# Altium schematic sheet Surface V2.0.SchDoc
size A4
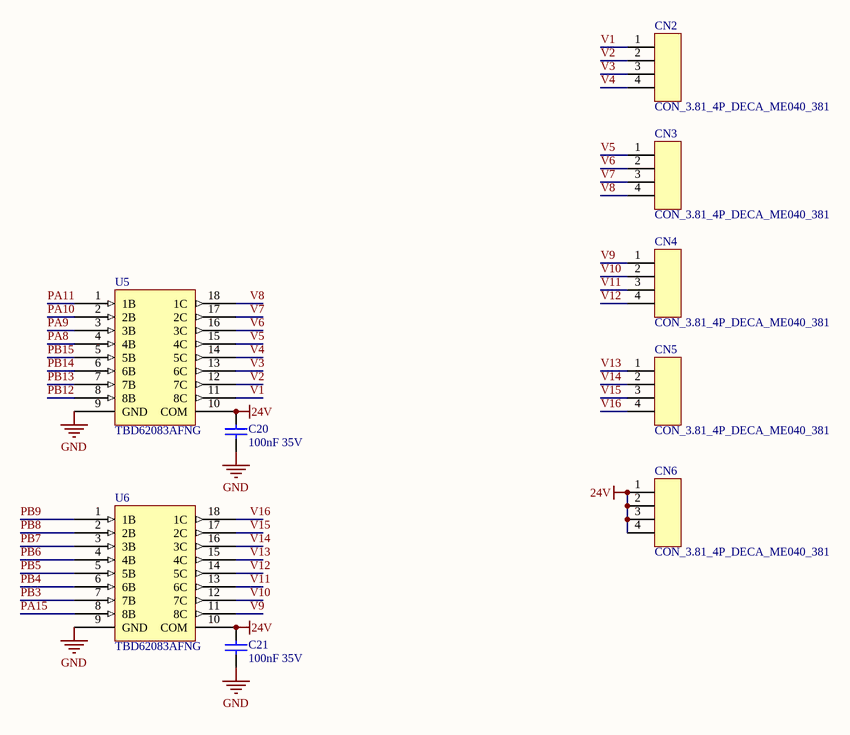
[diagram p0: Surface V2.0.SchDoc]

## Parts
C20  100nF 35V  [C0603]
C21  100nF 35V  [C0603]
CN2  CON_3.81_4P_DECA_ME040_381  [ME040_381_4P_VC-1]
CN3  CON_3.81_4P_DECA_ME040_381  [ME040_381_4P_VC-1]
CN4  CON_3.81_4P_DECA_ME040_381  [ME040_381_4P_VC-1]
CN5  CON_3.81_4P_DECA_ME040_381  [ME040_381_4P_VC-1]
CN6  CON_3.81_4P_DECA_ME040_381  [ME040_381_4P_VC-1]
U5  TBD62083AFNG  [SSOP18-0.65]
U6  TBD62083AFNG  [SSOP18-0.65]

## Nets
24V: C20.2 C21.2 CN6.1 CN6.2 CN6.3 CN6.4 U5.10(COM) U6.10(COM)
GND: C20.1 C21.1 U5.9(GND) U6.9(GND)
PA8: U5.4(4B)
PA9: U5.3(3B)
PA10: U5.2(2B)
PA11: U5.1(1B)
PA15: U6.8(8B)
PB3: U6.7(7B)
PB4: U6.6(6B)
PB5: U6.5(5B)
PB6: U6.4(4B)
PB7: U6.3(3B)
PB8: U6.2(2B)
PB9: U6.1(1B)
PB12: U5.8(8B)
PB13: U5.7(7B)
PB14: U5.6(6B)
PB15: U5.5(5B)
V1: CN2.1 U5.11(8C)
V2: CN2.2 U5.12(7C)
V3: CN2.3 U5.13(6C)
V4: CN2.4 U5.14(5C)
V5: CN3.1 U5.15(4C)
V6: CN3.2 U5.16(3C)
V7: CN3.3 U5.17(2C)
V8: CN3.4 U5.18(1C)
V9: CN4.1 U6.11(8C)
V10: CN4.2 U6.12(7C)
V11: CN4.3 U6.13(6C)
V12: CN4.4 U6.14(5C)
V13: CN5.1 U6.15(4C)
V14: CN5.2 U6.16(3C)
V15: CN5.3 U6.17(2C)
V16: CN5.4 U6.18(1C)

## Library data of the parts
C20 C21 = CAP
CN2-CN6 = CON_3.81_4P_DECA_ME040_381: DECA connector,3.81mm,1*4P,180度; PartNumber: ME040-381-4P; Manufacturer: DECA
U5 U6 = ULN2803: 达林顿晶体管阵列